# EAGLE design LickDetectorSubCkt_IsolatedDiscreteComponents (EAGLE 8.1.1)
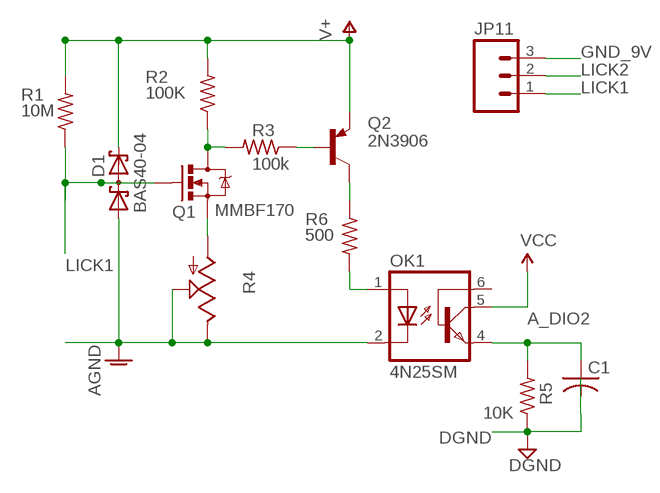
[diagram p0: schematic, sheet 1]

## Parts
C1  C-US025-024X044  [C025-024X044]
D1  BAS40-04  [SOT23]
JP11  M03POLAR  [MOLEX-1X3]
OK1  4N25SM  [DIL6-SMD]
Q1  MMBF170  MOSFET-NCHANNELAO3404A  [SOT23-3]
Q2  2N3906  MMBT3906LT1-PNP-SOT23-BEC  [SOT23-BEC]
R1  10M  RESISTOR_SM0805S  [0805S]
R2  100K  RESISTOR_SM0805S  [0805S]
R3  100k  RESISTOR_SM0805S  [0805S]
R4  TRIM_US-B25P  [B25P]
R5  10K  RESISTOR_SM0805S  [0805S]
R6  500  RESISTOR_SM0805S  [0805S]

## Nets
A_DIO2: C1.1 OK1.4(EMI) R5.2
AGND: D1.1(A1) OK1.2(C) R4.E R4.S
DGND: C1.2 R5.1
GND_9V: JP11.3
LICK1: D1.3(C1A2) JP11.1 Q1.1(G) R1.1
LICK2: JP11.2
N$6: Q1.2(S) R4.A
N$28: Q1.3(D) R2.1 R3.2
N$30: Q2.B R3.1
N$31: OK1.1(A) R6.2
N$32: Q2.C R6.1
V+: D1.2(C2) Q2.E R1.2 R2.2
VCC: OK1.5(COL)
Unconnected: OK1.6(BAS)

## Library data of the parts
C1 = adafruit:C-US: CAPACITOR, American symbol
D1 = diode:BAS40-04: Silicon Schottky Diodes General-purpose diode for high-speed switching
JP11 = SparkFun:M03: Header 3 Standard 3-pin 0.1" header. Use with straight break away headers (SKU : PRT-00116), right angle break away headers (PRT-00553), swiss pins (PRT-00743), machine pins (PRT-00117), and female headers (PRT-00115). Molex polarized connector foot print use with SKU : PRT-08232 with associated crimp pins and housings.
OK1 = optocoupler:4N*?M: General Purpose 6-Pin Phototransistor Optocouplers Source: http://www.fairchildsemi.com/ds/4N/4N35-M.pdf; MF: FAIRCHILD SEMICONDUCTOR; MPN: 4N25SM; OC_FARNELL: 1021152; OC_NEWARK: 34C2020
Q1 = SparkFun-DiscreteSemi:MOSFET-NCHANNEL: Common NMOSFET Parts MFG P/N Store ID Prod ID FDD8780 TRANS-09984 SI7820DN TRANS-11055 FDS6630A IC-08089 2N7002PW TRANS-11151 FQP30N06L COM-10213 TRANS-10060 BSS123LT1G TRANS-08345 BSS138 TRANS-00830 BS170 2N7000; PROD_ID: TRAN-12988
Q2 = transistor:*-PNP-: PNP Transistror
R1-R3 R5 R6 = SteveS:RESISTOR_SM
R4 = pot:TRIM_US-: POTENTIOMETER

## Board
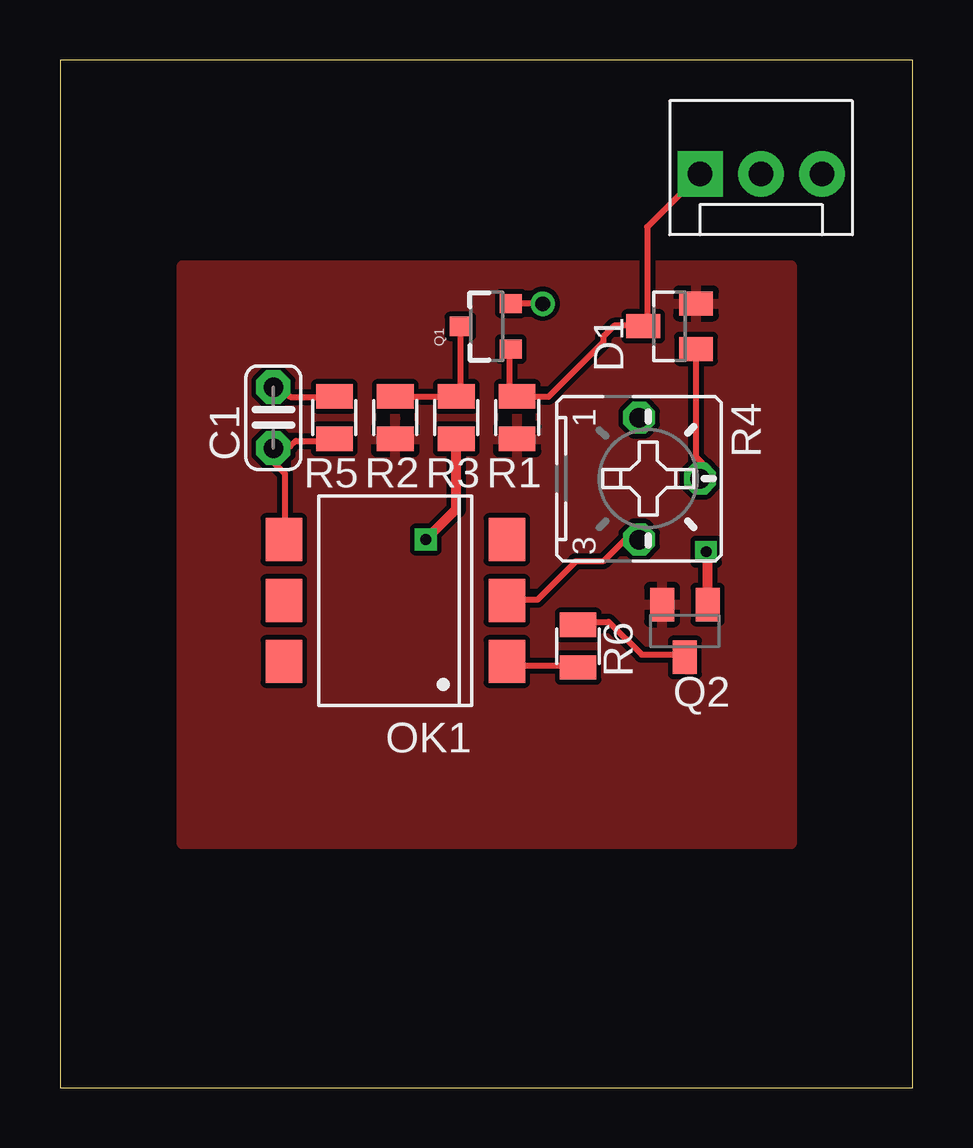
[diagram p1: board, top side]
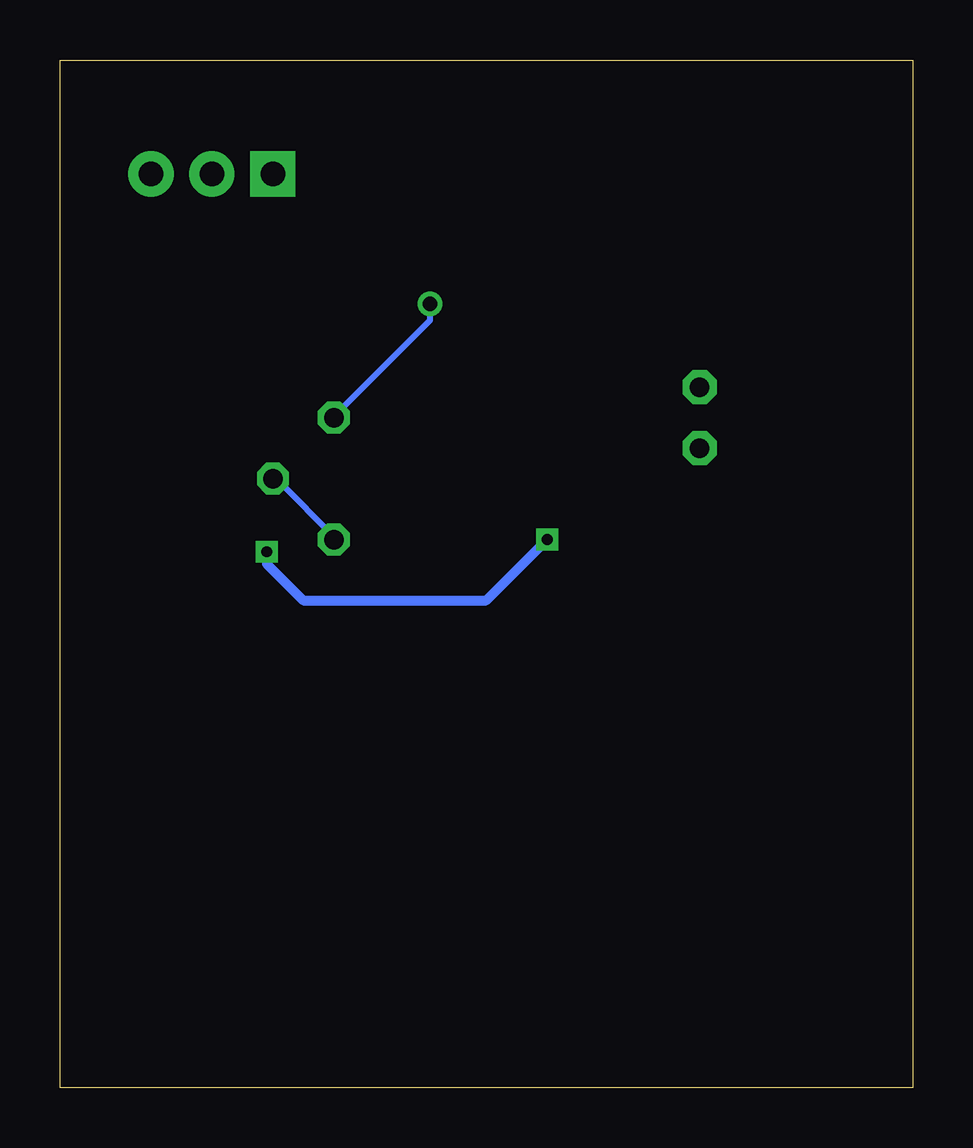
[diagram p2: board, bottom side, seen from below]

Size 35.54 x 42.85 mm. Coordinates in mm from the lower left corner, seen from the top.
Outline: 0,0 35.54,0 35.54,42.85 0,42.85 0,0
Copper layers (1*16): Top 0.035mm / dielectric 1.5mm / Bottom 0.035mm
Design rules "default": minimum track width 10mil, minimum drill 24mil, track to track 8mil, track to pad 8mil, pad to pad 8mil, via to via 8mil, smd to smd 8mil, copper to edge 40mil, drill to drill 8mil, minimum pad ring 10mil, minimum via ring 8mil, stop-mask expansion 4mil, vias tented up to drill 0mil, thermal gap 10mil

### Footprints (pad centres in the part's own frame; a part is rotated, then mirrored left to right if it is on the bottom)
C025-024X044 = drill 0.813 pad 1.422 octagon: 1 -1.27,0; 2 1.27,0
SOT23 = smd 1 x 1.4: 1 -0.95,-1.1; 2 0.95,-1.1; 3 0,1.1
MOLEX-1X3 = drill 1.016 pad 1.88 square: 1 0,0 | drill 1.016 pad 1.88: 2 2.54,0; 3 5.08,0
DIL6-SMD = smd 1.78 x 1.52: 1 -2.54,-4.645; 2 0,-4.645; 3 2.54,-4.645; 4 2.54,4.645; 5 0,4.645; 6 -2.54,4.645
SOT23-3 = smd 0.8 x 0.9: 1 -0.95,-1; 2 0.95,-1; 3 0,1.1
SOT23-BEC = smd 1 x 1.4: B -0.95,-1.1; C 0,1.1; E 0.95,-1.1
0805S = smd 1.016 x 1.524: 1 -0.889,0; 2 0.889,0
B25P = drill 0.813 octagon: A -2.54,0; E 2.54,0; S 0,2.54

### Placement (x,y rotation side)
C1  8.89,27.94 90 top
D1  25.4,31.75 90 top
JP11  26.67,38.1 0 top
OK1  13.97,20.32 90 top
Q1  17.78,31.75 90 top
Q2  26.04,19.05 180 top
R1  19.05,27.94 270 top
R2  13.97,27.94 270 top
R3  16.51,27.94 90 top
R4  24.13,25.4 270 top
R5  11.43,27.94 270 top
R6  21.59,18.41 270 top

### Tracks (layer width: path | path; a pad name or v marks a point on that pad's centre or on a via)
A_DIO2
  Top 0.254: R5.2 11.43,26.98 9.83,26.98 9.6,26.75 8.91,26.75 C1.1 8.91,26.52 8.91,26.06 9.37,25.6 9.37,22.86 OK1.4
AGND
  Top 0.254: D1.1 26.52,30.63 26.52,26.29 26.75,26.06 26.75,25.6 R4.S | R4.E 23.55,22.86 22.63,21.95 21.49,21.95 19.89,20.34 18.75,20.34 OK1.2
  Bottom 0.254: R4.S 26.52,25.38 24,22.86 R4.E
DGND
  Top 0.254: R5.1 11.43,28.8 9.6,28.8 9.37,29.03 8.91,29.03 C1.2
LICK1
  Top 0.254: Q1.1 18.75,30.63 18.75,29.03 18.97,28.8 R1.1 19.2,28.8 20.34,28.8 22.63,31.09 22.63,31.32 23.09,31.77 24.23,31.77 D1.3 24.46,31.77 24.46,35.89 JP11.1
N$6  (via drill 0.61)
  Top 0.254: v20.12,32.69 18.97,32.69 Q1.2
  Bottom 0.254: v20.12,32.69 20.12,32 24,28.12 R4.A
N$28
  Top 0.254: Q1.3 16.69,31.55 16.69,29.03 R3.2 16.46,28.8 14.17,28.8 R2.1
N$30  (via drill 0.45 pad 0.9)
  Top 0.254: 16.23,26.75 16.46,26.98 R3.1 | 26.98,20.34 Q2.B
  Top 0.406: Q2.B 26.98,22.29 v26.92,22.35 | v15.24,22.86 16.51,24.13 R3.1
  Bottom 0.406: v26.92,22.35 26.92,21.84 25.4,20.32 17.78,20.32 v15.24,22.86
N$31
  Top 0.254: R6.2 21.49,17.6 18.75,17.6 OK1.1
N$32
  Top 0.254: Q2.C 25.83,18.06 24.23,18.06 22.86,19.43 21.72,19.43 R6.1
V+
  pour Top: 5.08,34.29 30.48,34.29 30.48,10.16 5.08,10.16